# Altium schematic sheet Power Board UCC28951.SchDoc
size B
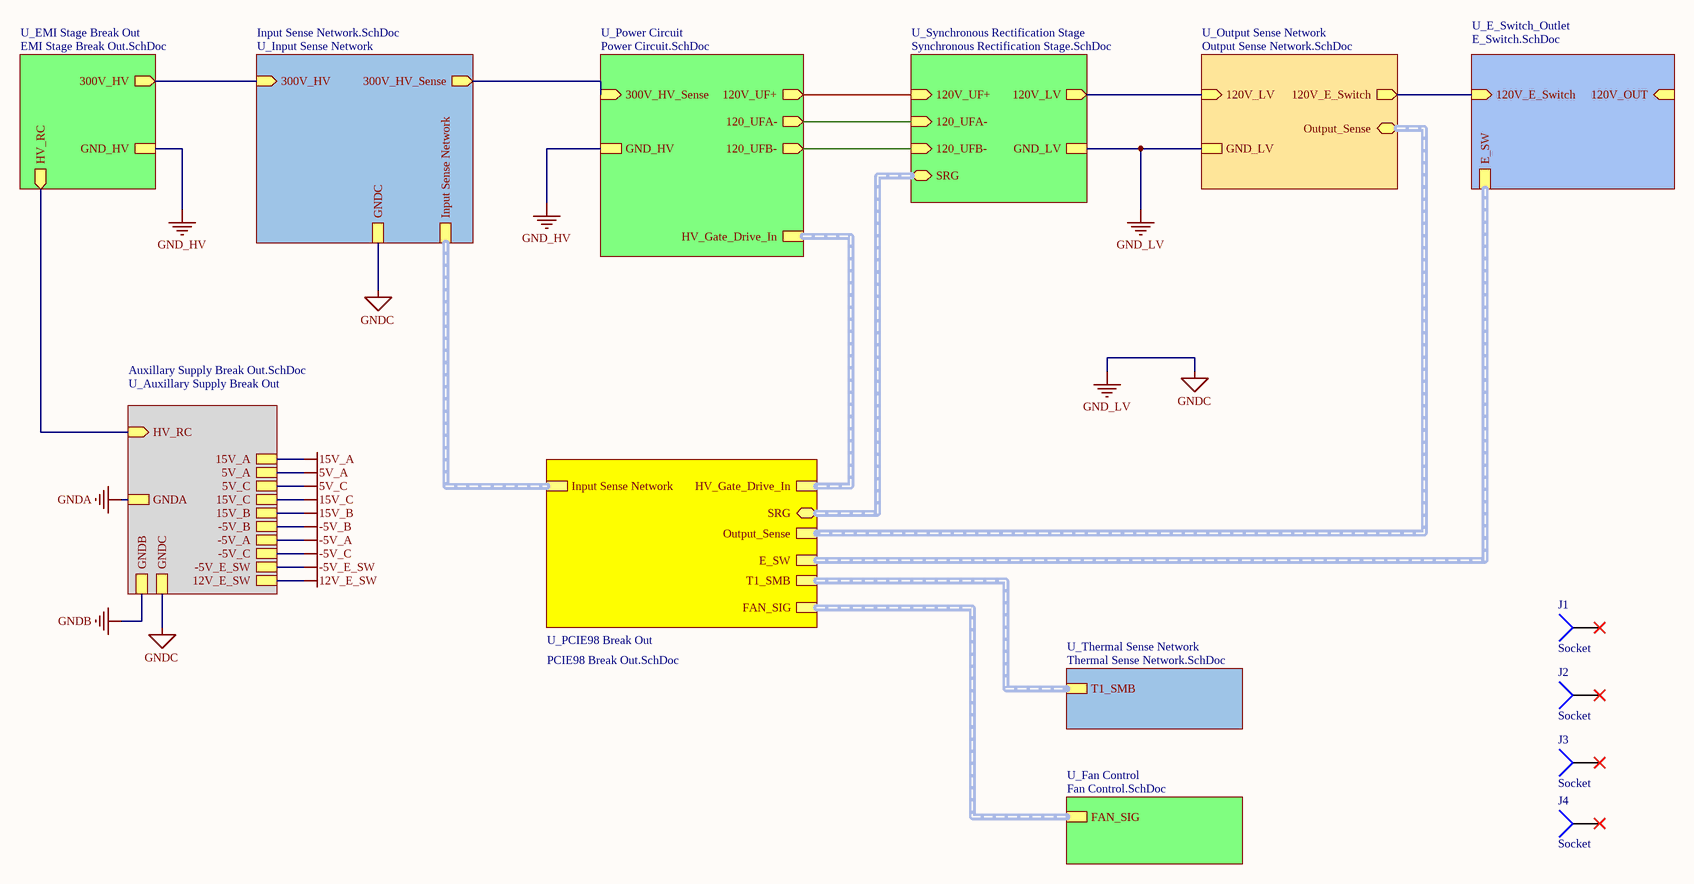
[diagram p0: Power Board UCC28951.SchDoc]

## Parts
J1  Socket  [Mounting_screw_3mm]
J2  Socket  [Mounting_screw_3mm]
J3  Socket  [Mounting_screw_3mm]
J4  Socket  [Mounting_screw_3mm]

## Sub-sheets
U_Auxillary Supply Break Out = Auxillary Supply Break Out.SchDoc: 15V_A, 5V_A, 15V_B, GNDB, GNDA, 5V_C, 15V_C, GNDC, -5V_B, -5V_A, -5V_C, -5V_E_SW, 12V_E_SW, HV_RC (in)
U_E_Switch_Outlet = E_Switch.SchDoc: 120V_E_Switch (in), 120V_OUT (in), E_SW (harness E_SW)
U_EMI Stage Break Out = EMI Stage Break Out.SchDoc: 300V_HV (out), GND_HV, HV_RC (out)
U_Fan Control = Fan Control.SchDoc: FAN_SIG (harness FAN_SIG)
U_Input Sense Network = Input Sense Network.SchDoc: 300V_HV (in), 300V_HV_Sense (out), GNDC, Input Sense Network (harness Input Sense Network)
U_Output Sense Network = Output Sense Network.SchDoc: 120V_LV (in), GND_LV, Output_Sense (bidir, harness Output_Sense), 120V_E_Switch (out)
U_PCIE98 Break Out = PCIE98 Break Out.SchDoc: Input Sense Network (harness Input Sense Network), HV_Gate_Drive_In (harness HV_Gate_Drive_In), SRG (bidir, harness SRG), Output_Sense (harness Output_Sense), E_SW (harness E_SW), T1_SMB (harness T1_SMB), FAN_SIG (harness FAN_SIG)
U_Power Circuit = Power Circuit.SchDoc: 300V_HV_Sense (in), GND_HV, 120V_UF+ (out), 120_UFA- (out), 120_UFB- (out), HV_Gate_Drive_In (harness HV_Gate_Drive_In)
U_Synchronous Rectification Stage = Synchronous Rectification Stage.SchDoc: 120V_UF+ (in), GND_LV, 120V_LV (out), 120_UFA- (in), 120_UFB- (in), SRG (bidir, harness SRG)
U_Thermal Sense Network = Thermal Sense Network.SchDoc: T1_SMB (harness T1_SMB)

## Nets
5V_A: sheet U_Auxillary Supply Break Out/5V_A
5V_C: sheet U_Auxillary Supply Break Out/5V_C
12V_E_SW: sheet U_Auxillary Supply Break Out/12V_E_SW
15V_A: sheet U_Auxillary Supply Break Out/15V_A
15V_B: sheet U_Auxillary Supply Break Out/15V_B
15V_C: sheet U_Auxillary Supply Break Out/15V_C
-5V_A: sheet U_Auxillary Supply Break Out/-5V_A
-5V_B: sheet U_Auxillary Supply Break Out/-5V_B
-5V_C: sheet U_Auxillary Supply Break Out/-5V_C
-5V_E_SW: sheet U_Auxillary Supply Break Out/-5V_E_SW
GND_HV: sheet U_Power Circuit/GND_HV, sheet U_EMI Stage Break Out/GND_HV
GND_LV: sheet U_Auxillary Supply Break Out/GNDC, sheet U_Output Sense Network/GND_LV, sheet U_Input Sense Network/GNDC, sheet U_Synchronous Rectification Stage/GND_LV  [also labelled GNDC]
GNDA: sheet U_Auxillary Supply Break Out/GNDA
GNDB: sheet U_Auxillary Supply Break Out/GNDB
(unnamed): sheet U_Power Circuit/300V_HV_Sense, sheet U_Input Sense Network/300V_HV_Sense
(unnamed): sheet U_Power Circuit/120V_UF+, sheet U_Synchronous Rectification Stage/120V_UF+
(unnamed): sheet U_Power Circuit/120_UFA-, sheet U_Synchronous Rectification Stage/120_UFA-
(unnamed): sheet U_Power Circuit/120_UFB-, sheet U_Synchronous Rectification Stage/120_UFB-
(unnamed): sheet U_Auxillary Supply Break Out/HV_RC, sheet U_EMI Stage Break Out/HV_RC
(unnamed): sheet U_EMI Stage Break Out/300V_HV, sheet U_Input Sense Network/300V_HV
(unnamed): sheet U_Output Sense Network/120V_LV, sheet U_Synchronous Rectification Stage/120V_LV
(unnamed): sheet U_Output Sense Network/120V_E_Switch, sheet U_E_Switch_Outlet/120V_E_Switch

Not connected (* = marked no-connect by the designer): J1 1*; J2 1*; J3 1*; J4 1*

## Buses and harness runs
harness sheet U_E_Switch_Outlet/E_SW = sheet U_PCIE98 Break Out/E_SW
harness sheet U_Fan Control/FAN_SIG = sheet U_PCIE98 Break Out/FAN_SIG
harness sheet U_Input Sense Network/Input Sense Network = sheet U_PCIE98 Break Out/Input Sense Network
harness sheet U_Output Sense Network/Output_Sense = sheet U_PCIE98 Break Out/Output_Sense
harness sheet U_PCIE98 Break Out/HV_Gate_Drive_In = sheet U_Power Circuit/HV_Gate_Drive_In
harness sheet U_PCIE98 Break Out/SRG = sheet U_Synchronous Rectification Stage/SRG
harness sheet U_PCIE98 Break Out/T1_SMB = sheet U_Thermal Sense Network/T1_SMB

## Library data of the parts
J1-J4 = Socket: LatestRevisionDate: 17-Jul-2002; LatestRevisionNote: Re-released for DXP Platform.; Publisher: Altium Limited